# Altium schematic sheet X7A15T-Fabric.SchDoc: =Board +' X7A15T-FPGA2'
size A3; Address1: Hans-Bunte-Strasse 19; Address2: D-79108 Freiburg; Address3: Germany; SheetNumber: 72; SheetTotal: 80; Date: OCT 2018; CheckedBy: ALL; Author: Moerz; CompanyName: TDK-Micronas GmbH; DrawnBy: Moerz; Engineer: Moerz; DateDraw: OCT 2018; DateChecked: N/A; PageSetup: Record=PageOptions|CenterHorizontal=True|CenterVertical=True|PrintScale=0.97|XCorrection=1.00|YCorrection=1.00|PrintKind=0|BorderSize=5000000|LeftOffset=0|BottomOffset=0|Orientation=2|PaperLength=1000|PaperWidth=1000|Scale=100|PaperSource=7|PrintQuality=-3|MediaType=1|DitherType=10|PrintScaleMode=1|PaperKind=A4|PaperIndex=9; TitleTyp: Title-Typ; Block: CPU & SCT8; Workspace: Workspace
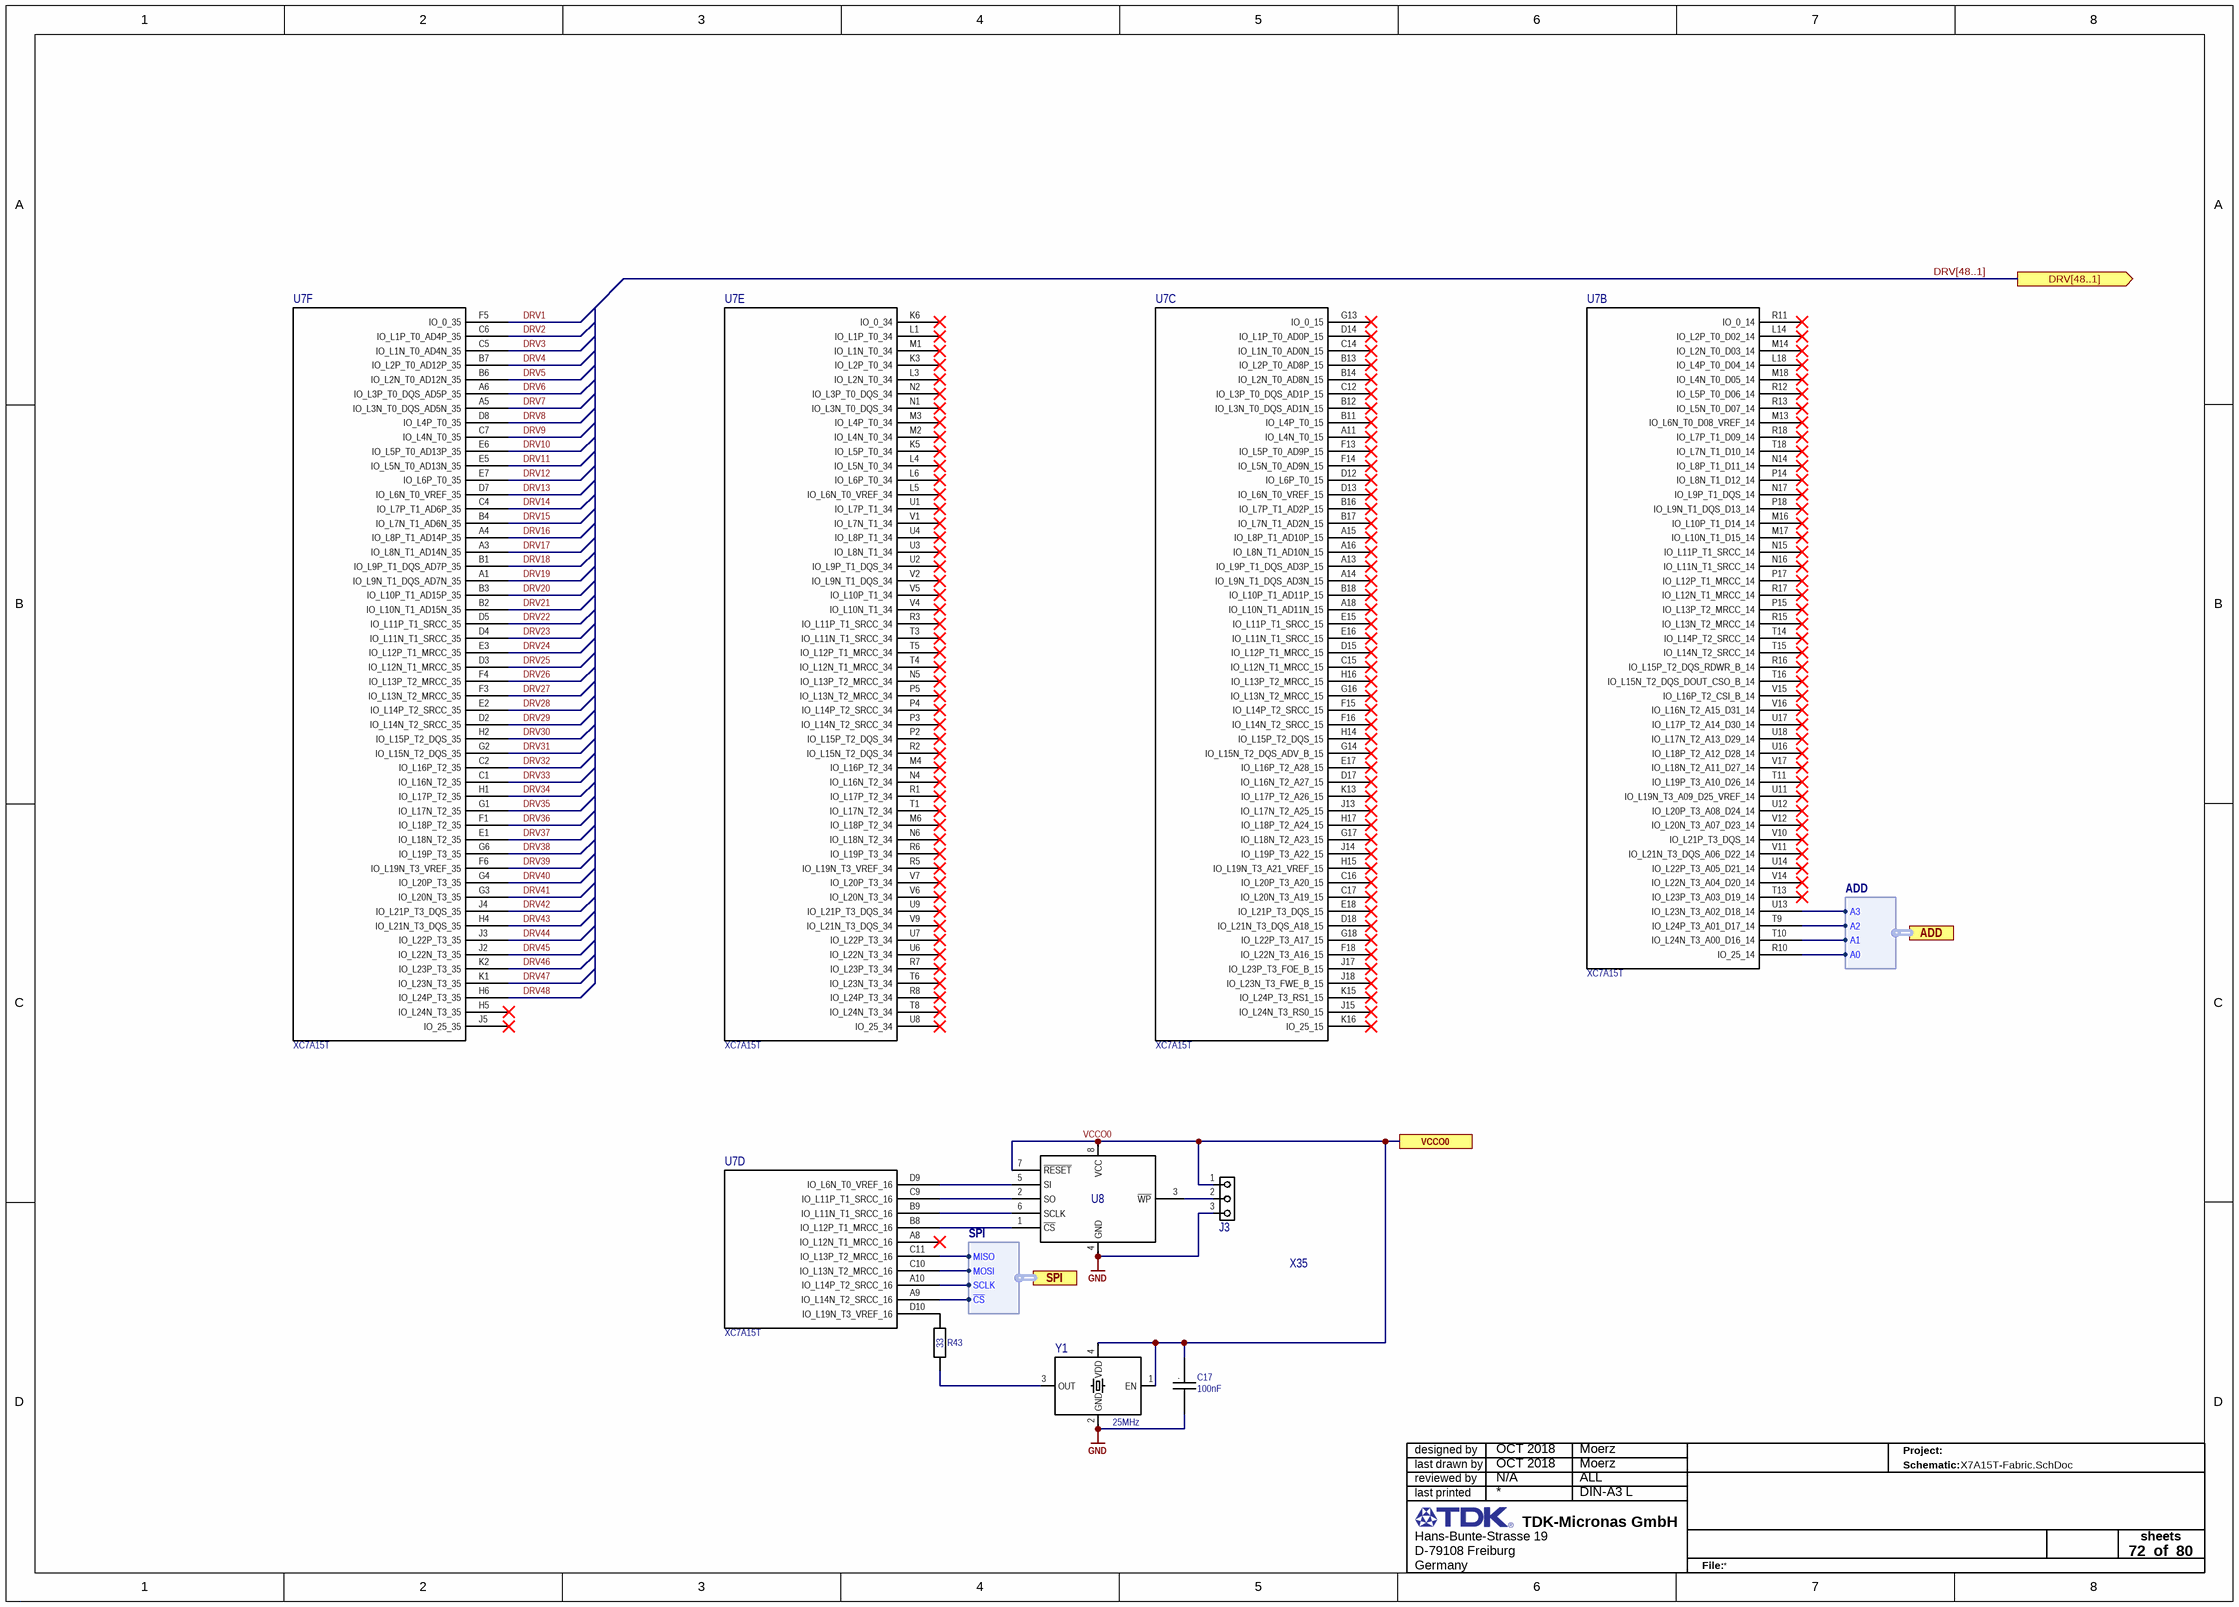
[diagram p0: X7A15T-Fabric.SchDoc]

## Parts
C17  value 100nF  [C0402 Reflow]  (hidden comment: C)
J3  J  [Header 100mil 3x1]  (value not drawn)
R43  value 33  [R0402 Reflow]  (hidden comment: R)
U7  NicName: XC7A15T  [XC7A15T-1CSG324C]  (hidden comment: U)  (parts B,C,D,E,F of 8)
U8  U  [SOIC8 (R-8)]  (value not drawn)
X35  X  (value not drawn)
Y1  Frequency: 25MHz  [4SMD]  (hidden comment: Y)

## Ports
ADD (harness ADD), DRV[48..1] (out), SPI (harness SPI), VCCO0

## Harnesses
SPI: MISO, MOSI, SCLK, ~{CS}
ADD: A3, A2, A1, A0

## Nets
GND: C17.2 J3.3 U8.4(GND) Y1.2(GND)
DRV1: U7.F5(IO_0_35)
DRV2: U7.C6(IO_L1P_T0_AD4P_35)
DRV3: U7.C5(IO_L1N_T0_AD4N_35)
DRV4: U7.B7(IO_L2P_T0_AD12P_35)
DRV5: U7.B6(IO_L2N_T0_AD12N_35)
DRV6: U7.A6(IO_L3P_T0_DQS_AD5P_35)
DRV7: U7.A5(IO_L3N_T0_DQS_AD5N_35)
DRV8: U7.D8(IO_L4P_T0_35)
DRV9: U7.C7(IO_L4N_T0_35)
DRV10: U7.E6(IO_L5P_T0_AD13P_35)
DRV11: U7.E5(IO_L5N_T0_AD13N_35)
DRV12: U7.E7(IO_L6P_T0_35)
DRV13: U7.D7(IO_L6N_T0_VREF_35)
DRV14: U7.C4(IO_L7P_T1_AD6P_35)
DRV15: U7.B4(IO_L7N_T1_AD6N_35)
DRV16: U7.A4(IO_L8P_T1_AD14P_35)
DRV17: U7.A3(IO_L8N_T1_AD14N_35)
DRV18: U7.B1(IO_L9P_T1_DQS_AD7P_35)
DRV19: U7.A1(IO_L9N_T1_DQS_AD7N_35)
DRV20: U7.B3(IO_L10P_T1_AD15P_35)
DRV21: U7.B2(IO_L10N_T1_AD15N_35)
DRV22: U7.D5(IO_L11P_T1_SRCC_35)
DRV23: U7.D4(IO_L11N_T1_SRCC_35)
DRV24: U7.E3(IO_L12P_T1_MRCC_35)
DRV25: U7.D3(IO_L12N_T1_MRCC_35)
DRV26: U7.F4(IO_L13P_T2_MRCC_35)
DRV27: U7.F3(IO_L13N_T2_MRCC_35)
DRV28: U7.E2(IO_L14P_T2_SRCC_35)
DRV29: U7.D2(IO_L14N_T2_SRCC_35)
DRV30: U7.H2(IO_L15P_T2_DQS_35)
DRV31: U7.G2(IO_L15N_T2_DQS_35)
DRV32: U7.C2(IO_L16P_T2_35)
DRV33: U7.C1(IO_L16N_T2_35)
DRV34: U7.H1(IO_L17P_T2_35)
DRV35: U7.G1(IO_L17N_T2_35)
DRV36: U7.F1(IO_L18P_T2_35)
DRV37: U7.E1(IO_L18N_T2_35)
DRV38: U7.G6(IO_L19P_T3_35)
DRV39: U7.F6(IO_L19N_T3_VREF_35)
DRV40: U7.G4(IO_L20P_T3_35)
DRV41: U7.G3(IO_L20N_T3_35)
DRV42: U7.J4(IO_L21P_T3_DQS_35)
DRV43: U7.H4(IO_L21N_T3_DQS_35)
DRV44: U7.J3(IO_L22P_T3_35)
DRV45: U7.J2(IO_L22N_T3_35)
DRV46: U7.K2(IO_L23P_T3_35)
DRV47: U7.K1(IO_L23N_T3_35)
DRV48: U7.H6(IO_L24P_T3_35)
VCCO0: C17.1 J3.1 U8.7(~{RESET}) U8.8(VCC) Y1.1(EN) Y1.4(VDD) ; port VCCO0
NetJ3_2: J3.2 U8.3(~{WP})
NetR43_1: R43.1 Y1.3(OUT)
NetR43_2: R43.2 U7.D10(IO_L19N_T3_VREF_16)
NetU7_A9: U7.A9(IO_L14N_T2_SRCC_16) ; port SPI.~{CS}
NetU7_A10: U7.A10(IO_L14P_T2_SRCC_16) ; port SPI.SCLK
NetU7_B8: U7.B8(IO_L12P_T1_MRCC_16) U8.1(~{CS})
NetU7_B9: U7.B9(IO_L11N_T1_SRCC_16) U8.6(SCLK)
NetU7_C9: U7.C9(IO_L11P_T1_SRCC_16) U8.2(SO)
NetU7_C10: U7.C10(IO_L13N_T2_MRCC_16) ; port SPI.MOSI
NetU7_C11: U7.C11(IO_L13P_T2_MRCC_16) ; port SPI.MISO
NetU7_D9: U7.D9(IO_L6N_T0_VREF_16) U8.5(SI)
NetU7_R10: U7.R10(IO_25_14) ; port ADD.A0
NetU7_T9: U7.T9(IO_L24P_T3_A01_D17_14) ; port ADD.A2
NetU7_T10: U7.T10(IO_L24N_T3_A00_D16_14) ; port ADD.A1
NetU7_U13: U7.U13(IO_L23N_T3_A02_D18_14) ; port ADD.A3

Not connected (* = marked no-connect by the designer): U7 A8(IO_L12N_T1_MRCC_16)* A11(IO_L4N_T0_15)* A13(IO_L9P_T1_DQS_AD3P_15)* A14(IO_L9N_T1_DQS_AD3N_15)* A15(IO_L8P_T1_AD10P_15)* A16(IO_L8N_T1_AD10N_15)* A18(IO_L10N_T1_AD11N_15)* B11(IO_L4P_T0_15)* B12(IO_L3N_T0_DQS_AD1N_15)* B13(IO_L2P_T0_AD8P_15)* B14(IO_L2N_T0_AD8N_15)* B16(IO_L7P_T1_AD2P_15)* B17(IO_L7N_T1_AD2N_15)* B18(IO_L10P_T1_AD11P_15)* C12(IO_L3P_T0_DQS_AD1P_15)* C14(IO_L1N_T0_AD0N_15)* C15(IO_L12N_T1_MRCC_15)* C16(IO_L20P_T3_A20_15)* C17(IO_L20N_T3_A19_15)* D12(IO_L6P_T0_15)* D13(IO_L6N_T0_VREF_15)* D14(IO_L1P_T0_AD0P_15)* D15(IO_L12P_T1_MRCC_15)* D17(IO_L16N_T2_A27_15)* D18(IO_L21N_T3_DQS_A18_15)* E15(IO_L11P_T1_SRCC_15)* E16(IO_L11N_T1_SRCC_15)* E17(IO_L16P_T2_A28_15)* E18(IO_L21P_T3_DQS_15)* F13(IO_L5P_T0_AD9P_15)* F14(IO_L5N_T0_AD9N_15)* F15(IO_L14P_T2_SRCC_15)* F16(IO_L14N_T2_SRCC_15)* F18(IO_L22N_T3_A16_15)* G13(IO_0_15)* G14(IO_L15N_T2_DQS_ADV_B_15)* G16(IO_L13N_T2_MRCC_15)* G17(IO_L18N_T2_A23_15)* G18(IO_L22P_T3_A17_15)* H5(IO_L24N_T3_35)* H14(IO_L15P_T2_DQS_15)* H15(IO_L19N_T3_A21_VREF_15)* H16(IO_L13P_T2_MRCC_15)* H17(IO_L18P_T2_A24_15)* J5(IO_25_35)* J13(IO_L17N_T2_A25_15)* J14(IO_L19P_T3_A22_15)* J15(IO_L24N_T3_RS0_15)* J17(IO_L23P_T3_FOE_B_15)* J18(IO_L23N_T3_FWE_B_15)* K3(IO_L2P_T0_34)* K5(IO_L5P_T0_34)* K6(IO_0_34)* K13(IO_L17P_T2_A26_15)* K15(IO_L24P_T3_RS1_15)* K16(IO_25_15)* L1(IO_L1P_T0_34)* L3(IO_L2N_T0_34)* L4(IO_L5N_T0_34)* L5(IO_L6N_T0_VREF_34)* L6(IO_L6P_T0_34)* L14(IO_L2P_T0_D02_14)* L18(IO_L4P_T0_D04_14)* M1(IO_L1N_T0_34)* M2(IO_L4N_T0_34)* M3(IO_L4P_T0_34)* M4(IO_L16P_T2_34)* M6(IO_L18P_T2_34)* M13(IO_L6N_T0_D08_VREF_14)* M14(IO_L2N_T0_D03_14)* M16(IO_L10P_T1_D14_14)* M17(IO_L10N_T1_D15_14)* M18(IO_L4N_T0_D05_14)* N1(IO_L3N_T0_DQS_34)* N2(IO_L3P_T0_DQS_34)* N4(IO_L16N_T2_34)* N5(IO_L13P_T2_MRCC_34)* N6(IO_L18N_T2_34)* N14(IO_L8P_T1_D11_14)* N15(IO_L11P_T1_SRCC_14)* N16(IO_L11N_T1_SRCC_14)* N17(IO_L9P_T1_DQS_14)* P2(IO_L15P_T2_DQS_34)* P3(IO_L14N_T2_SRCC_34)* P4(IO_L14P_T2_SRCC_34)* P5(IO_L13N_T2_MRCC_34)* P14(IO_L8N_T1_D12_14)* P15(IO_L13P_T2_MRCC_14)* P17(IO_L12P_T1_MRCC_14)* P18(IO_L9N_T1_DQS_D13_14)* R1(IO_L17P_T2_34)* R2(IO_L15N_T2_DQS_34)* R3(IO_L11P_T1_SRCC_34)* R5(IO_L19N_T3_VREF_34)* R6(IO_L19P_T3_34)* R7(IO_L23P_T3_34)* R8(IO_L24P_T3_34)* R11(IO_0_14)* R12(IO_L5P_T0_D06_14)* R13(IO_L5N_T0_D07_14)* R15(IO_L13N_T2_MRCC_14)* R16(IO_L15P_T2_DQS_RDWR_B_14)* R17(IO_L12N_T1_MRCC_14)* R18(IO_L7P_T1_D09_14)* T1(IO_L17N_T2_34)* T3(IO_L11N_T1_SRCC_34)* T4(IO_L12N_T1_MRCC_34)* T5(IO_L12P_T1_MRCC_34)* T6(IO_L23N_T3_34)* T8(IO_L24N_T3_34)* T11(IO_L19P_T3_A10_D26_14)* T13(IO_L23P_T3_A03_D19_14)* T14(IO_L14P_T2_SRCC_14)* T15(IO_L14N_T2_SRCC_14)* T16(IO_L15N_T2_DQS_DOUT_CSO_B_14)* T18(IO_L7N_T1_D10_14)* U1(IO_L7P_T1_34)* U2(IO_L9P_T1_DQS_34)* U3(IO_L8N_T1_34)* U4(IO_L8P_T1_34)* U6(IO_L22N_T3_34)* U7(IO_L22P_T3_34)* U8(IO_25_34)* U9(IO_L21P_T3_DQS_34)* U11(IO_L19N_T3_A09_D25_VREF_14)* U12(IO_L20P_T3_A08_D24_14)* U14(IO_L22P_T3_A05_D21_14)* U16(IO_L18P_T2_A12_D28_14)* U17(IO_L17P_T2_A14_D30_14)* U18(IO_L17N_T2_A13_D29_14)* V1(IO_L7N_T1_34)* V2(IO_L9N_T1_DQS_34)* V4(IO_L10N_T1_34)* V5(IO_L10P_T1_34)* V6(IO_L20N_T3_34)* V7(IO_L20P_T3_34)* V9(IO_L21N_T3_DQS_34)* V10(IO_L21P_T3_DQS_14)* V11(IO_L21N_T3_DQS_A06_D22_14)* V12(IO_L20N_T3_A07_D23_14)* V14(IO_L22N_T3_A04_D20_14)* V15(IO_L16P_T2_CSI_B_14)* V16(IO_L16N_T2_A15_D31_14)* V17(IO_L18N_T2_A11_D27_14)*

## Buses and harness runs
bus DRV[48..1] = port DRV[48..1]

## Notes on the sheet
- designed by
- reviewed by
- last drawn by
- Project:
- Schematic:
- last printed
- DIN-A3 L
- sheets
- of
- File:
- (in symbol C) .

## Library data of the parts
C17 = C: CAP CER 0.1UF 16V X7R 0402; 04. Manufacturer: KEMET; 07. Manufacturer  Part Number: C0402C104J4RACTU; Tolerance: ±5%; 03. Unit Price: 0.45; 13. Created Date/Name: AUG2018/Hören; Voltage Rating: 16V; Type: X7R; ComponentLink1Description: Info; ComponentLink1URL: https://www.digikey.de/product-detail/en/kemet/C0402C104J4RACTU/399-7761-6-ND/3472292; 02. Distributor Part Number: 399-7761-6-ND; 09. Operating Temperature: -55°C ~ 125°C; 11. RoHS: YES; 01. Distributor: DigiKey; ComponentLink2Description: DataSheet; ComponentLink2URL: https://content.kemet.com/datasheets/KEM_C1002_X7R_SMD.pdf; Package: 0402
J3 = Header 3Pins 100mil: CONN HEADER VERT 3POS 2.54MM; 04. Manufacturer: Samtec Inc.; 07. Manufacturer  Part Number: HMTSW-103-07-G-S-240; 03. Unit Price: 0.25; 13. Created Date/Name: AUG2018/Hören; 01. Distributor: Samtec Inc.; 02. Distributor Part Number: HMTSW-103-07-G-S-240; 11. RoHS: YES; ComponentLink1Description: Info; ComponentLink1URL: https://www.samtec.com/products/hmtsw-103-07-g-s-240; ComponentLink2Description: DataSheet; ComponentLink2URL: http://suddendocs.samtec.com/catalog_english/hmtsw.pdf
R43 = R: RES SMD 33 OHM 1% 1/16W 0402; 04. Manufacturer: Yageo; 07. Manufacturer  Part Number: RC0402FR-0733RL; 03. Unit Price: 0.09; 13. Created Date/Name: AUG2018/Hören; Power Rating: 63mW; Tolerance: ±1%; ComponentLink1URL: https://www.digikey.de/products/en?keywords=311-33.0LRDKR-ND; ComponentLink1Description: Info; 02. Distributor Part Number: 311-33.0LRDKR-ND; 09. Operating Temperature: -55°C ~ 155°C; 11. RoHS: YES; 01. Distributor: DigiKey; ComponentLink2Description: DataSheet; Type: Thick Film; Package: 0402
U7 = XC7A15T-CS324: XC7A15T-1CSG324C; MFR: XILINX; POPULATED: yes; 03. Unit Price: 20.65; MFR-PN: XC7A15T-CS324; 04. Manufacturer: XILINX; 07. Manufacturer  Part Number: XC7A15T-1CSG324C; 01. Distributor: Avnet; 02. Distributor Part Number: XC7A15T-1CSG324C; 09. Operating Temperature: 0°C ~ 85°C (TJ); 11. RoHS: YES; ComponentLink4Description: Info; ComponentLink4URL: https://www.digikey.de/products/en?keywords=XC7A15T-1CSG324C; ComponentLink5Description: DataSheet; ComponentLink5URL: https://www.xilinx.com/support/documentation/data_sheets/ds181_Artix_7_Data_Sheet.pdf; ComponentLink6Description: NXP; ComponentLink6URL: https://www.nxp.com/part/MK20DN512VMD10
U8 = MX25R3235FM1IH0: IC FLASH 32M SPI 80MHZ 8SOP; 13. Created Date/Name: AUG 2018 / Hören; ComponentLink1Description: Info; ComponentLink1URL: https://www.digikey.de/product-detail/en/macronix/MX25R3235FM1IH0/1092-1175-ND/5957736; ComponentLink2Description: DataSheet; ComponentLink2URL: https://www.macronix.com/Lists/Datasheet/Attachments/7534/MX25R3235F%2c%20Wide%20Range%2c%2032Mb%2c%20v1.6.pdf
X35 = Jumper: CONN JUMPER SHORTING .100" GOLD; 04. Manufacturer: Sullins Connector Solutions; 07. Manufacturer  Part Number: QPC02SXGN-RC; 03. Unit Price: 0.09; 13. Created Date/Name: AUG2018/Hören; 01. Distributor: DigiKey; 02. Distributor Part Number: S9337-ND; 09. Operating Temperature: -xx..+yy°C; 11. RoHS: ???; ComponentLink1Description: Info; ComponentLink1URL: https://www.digikey.de/product-detail/en/sullins-connector-solutions/QPC02SXGN-RC/S9337-ND/2618262; ComponentLink2Description: DataSheet
Y1 = ASE-25.000MHZ-LC-T: XTAL OSC XO 25.0000MHZ CMOS SMD; 04. Manufacturer: Abracon LLC; 03. Unit Price: 1.46; 13. Created Date/Name: AUG 2018 / Hören; 01. Distributor: DigiKey; 02. Distributor Part Number: 535-9568-1-ND; 07. Manufacturer  Part Number: ASE-25.000MHZ-LC-T; 11. RoHS: YES; ComponentLink1Description: Info; ComponentLink1URL: https://www.digikey.de/products/en?keywords=535-9568-1-ND; ComponentLink2Description: DataSheet; Package: 4SMD